# Altium schematic sheet I2C_Arbitration.SchDoc
size A; Organization: Altium Limited; Address1: L3, 12a Rodborough Rd; Address2: Frenchs Forest; Address3: NSW; Address4: Australia 2086; DocumentNumber: 2; SheetNumber: 2; SheetTotal: 8
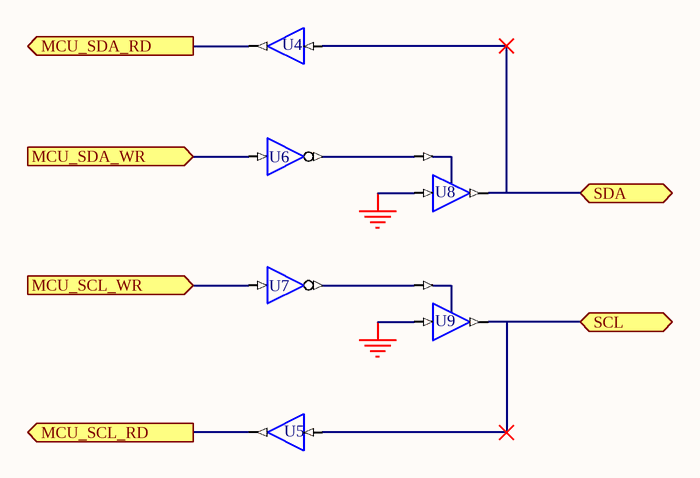
[diagram p0: I2C_Arbitration.SchDoc]

## Parts
U4  BUF  (value not drawn)
U5  BUF  (value not drawn)
U6  INV  (value not drawn)
U7  INV  (value not drawn)
U8  BUFE  (value not drawn)
U9  BUFE  (value not drawn)

## Ports
MCU_SCL_RD (out), MCU_SCL_WR (in), MCU_SDA_RD (out), MCU_SDA_WR (in), SCL (bidir), SDA (bidir)

## Nets
GND: U8.I U9.I
MCU_SCL_RD: U5.O ; port MCU_SCL_RD
MCU_SCL_WR: U7.I ; port MCU_SCL_WR
MCU_SDA_RD: U4.O ; port MCU_SDA_RD
MCU_SDA_WR: U6.I ; port MCU_SDA_WR
SCL: U5.I U9.O ; port SCL
SDA: U4.I U8.O ; port SDA
NetU6_O: U6.O U8.E
NetU7_O: U7.O U9.E

## Notes on the sheet
- Title
- Size:
- Date:
- A
- Number:
- Time:
- Revision:
- Sheet
- of
- File:

## Library data of the parts
U4 U5 = BUF: 1-bit General Purpose (Non-inverting) Buffer; ArchiveName: GENERIC; Published: 18-Dec-2003; Publisher: Altium Limited; Xilinx Equivalent: BUF; Core Revision: 1.00.00
U6 U7 = INV: Inverter; ArchiveName: GENERIC; Published: 18-Nov-2003; Publisher: Altium Limited; Xilinx Equivalent: INV; Core Revision: 1.00.00
U8 U9 = BUFE: 1-bit 3-state Buffer with Active High Enable; ArchiveName: GENERIC; Published: 18-Dec-2003; Publisher: Altium Limited; Xilinx Equivalent: BUFE; Core Revision: 1.00.00